# Altium schematic sheet SENSOR.SchDoc
size A
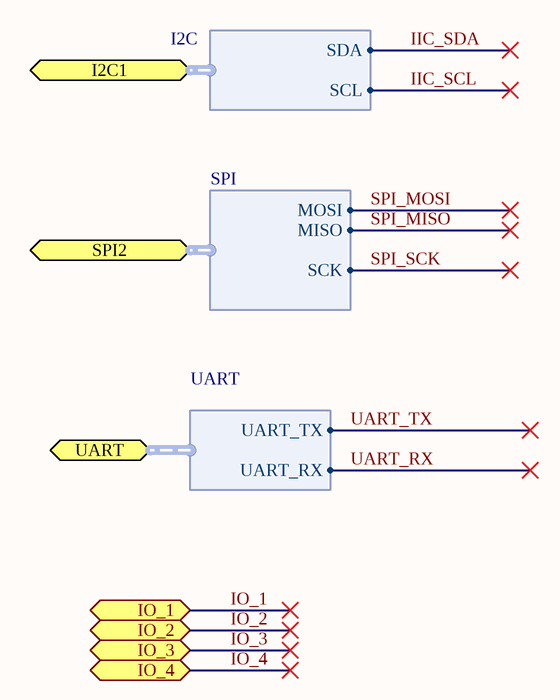
[diagram p0: SENSOR.SchDoc]

## Ports
I2C1 (harness I2C), IO_1, IO_2, IO_3, IO_4, SPI2 (harness SPI), UART (harness UART)

## Harnesses
I2C: SDA, SCL
SPI: MOSI, MISO, SCK
UART: UART_TX, UART_RX

## Nets
IIC_SCL: port I2C1.SCL
IIC_SDA: port I2C1.SDA
IO_1: port IO_1
IO_2: port IO_2
IO_3: port IO_3
IO_4: port IO_4
SPI_MISO: port SPI2.MISO
SPI_MOSI: port SPI2.MOSI
SPI_SCK: port SPI2.SCK
UART_RX: port UART.UART_RX
UART_TX: port UART.UART_TX